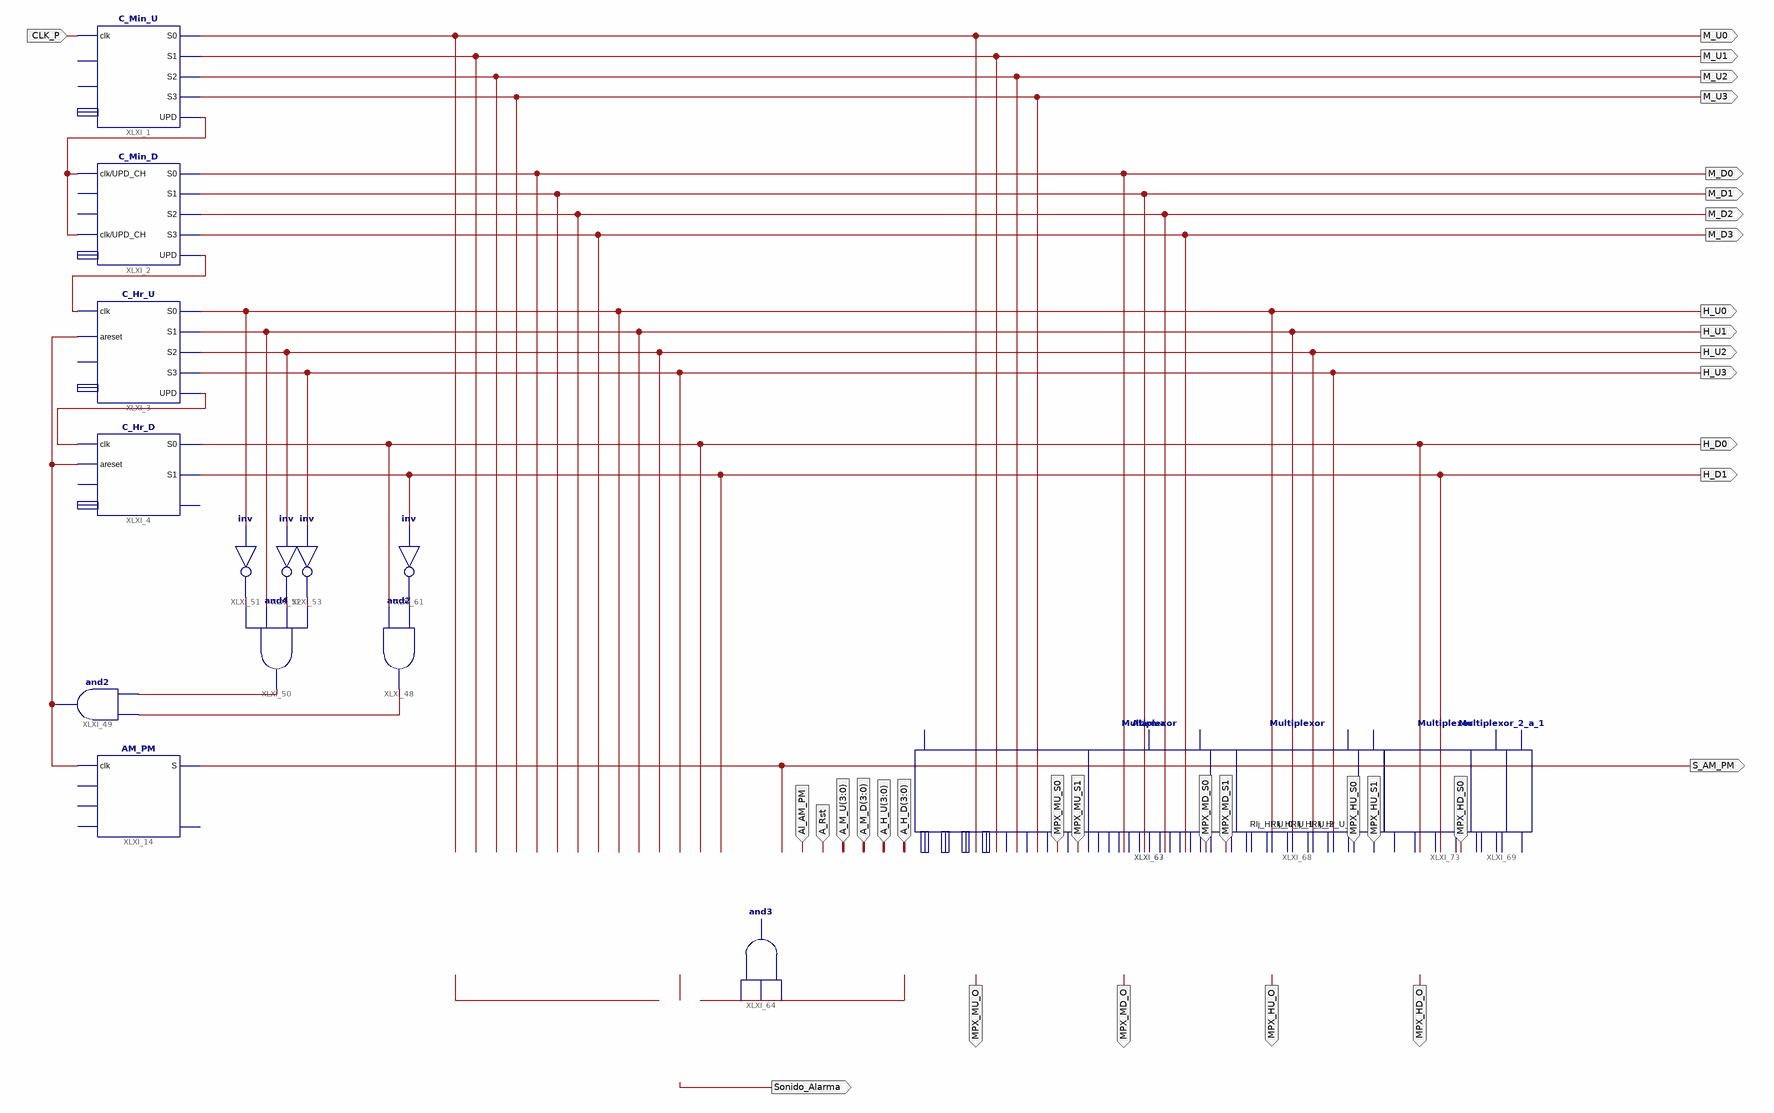
[diagram p0: schematic sheet 1]
// Xilinx ISE schematic Esquematico.sch (spartan3) as structural Verilog: 18 symbols, 34 ports
module Esquematico (
  input  CLK_P,
  input  Al_AM_PM,
  input  A_Rst,
  input  [3:0] A_M_U,
  input  [3:0] A_M_D,
  input  [3:0] A_H_U,
  input  [3:0] A_H_D,
  input  MPX_MU_S0,
  input  MPX_MU_S1,
  input  MPX_MD_S0,
  input  MPX_MD_S1,
  input  MPX_HU_S0,
  input  MPX_HU_S1,
  input  MPX_HD_S0,
  output M_U0,
  output M_U1,
  output M_U2,
  output M_U3,
  output M_D0,
  output M_D2,
  output M_D3,
  output M_D1,
  output H_U0,
  output H_D0,
  output H_U1,
  output H_U2,
  output H_U3,
  output H_D1,
  output S_AM_PM,
  output Sonido_Alarma,
  output MPX_HD_O,
  output MPX_HU_O,
  output MPX_MD_O,
  output MPX_MU_O
);

  wire XLXN_48, XLXN_51, XLXN_66, XLXN_128, XLXN_129, XLXN_130, XLXN_134, XLXN_143, XLXN_199, XLXN_201,
       XLXN_264, XLXN_265, XLXN_266;

  C_Min_U XLXI_1 (.clk(CLK_P), .S0(M_U0), .S1(M_U1), .S2(M_U2), .S3(M_U3), .UPD(XLXN_48));  // open: areset, aload, data
  C_Min_D XLXI_2 (
    .clk(XLXN_48), .UPD_CH(XLXN_48), .S0(M_D0), .S1(M_D1), .S2(M_D2), .S3(M_D3), .UPD(XLXN_51));  // open: areset, aload, data
  C_Hr_U XLXI_3 (
    .clk(XLXN_51), .areset(XLXN_201), .S0(H_U0), .S1(H_U1), .S2(H_U2), .S3(H_U3), .UPD(XLXN_66));  // open: aload, data
  C_Hr_D XLXI_4 (.clk(XLXN_66), .areset(XLXN_201), .S0(H_D0), .S1(H_D1));  // open: aload, data, UPD
  not XLXI_51 (XLXN_128, H_U0);
  not XLXI_52 (XLXN_129, H_U2);
  not XLXI_53 (XLXN_130, H_U3);
  and XLXI_50 (XLXN_143, XLXN_128, H_U1, XLXN_129, XLXN_130);
  and XLXI_48 (XLXN_199, H_D0, XLXN_134);
  not XLXI_61 (XLXN_134, H_D1);
  AM_PM XLXI_14 (.clk(XLXN_201), .S(S_AM_PM));  // open: areset, aload, data, UPD
  and XLXI_49 (XLXN_201, XLXN_199, XLXN_143);
  Alarma XLXI_63 (
    .Rlj_Min_U_0(M_U0), .Rlj_Min_U_1(M_U1), .Rlj_Min_U_2(M_U2), .Rlj_Min_U_3(M_U3), .Rlj_Min_D_0(M_D0),
    .Rlj_Min_D_1(M_D1), .Rlj_Min_D_2(M_D2), .Rlj_Min_D_3(M_D3), .Rlj_Hr_U_0(H_U0), .Rlj_Hr_U_1(H_U1),
    .Rlj_Hr_U_2(H_U2), .Rlj_Hr_U_3(H_U3), .Rlj_Hr_D_0(H_D0), .Rlj_Hr_D_1(H_D1), .Rlj_Am_Pm(S_AM_PM),
    .Alm_Am_Pm(Al_AM_PM), .Alm_Rst(A_Rst), .Alm_Min_U(A_M_U), .Alm_Min_D(A_M_D), .Alm_Hr_U(A_H_U),
    .Alm_Hr_D(A_H_D), .Sen_1(XLXN_264), .Sen_2(XLXN_265), .Sen_3(XLXN_266));  // open: Rlj_Hr_D_2, Rlj_Hr_D_3
  and XLXI_64 (Sonido_Alarma, XLXN_266, XLXN_265, XLXN_264);
  Multiplexor XLXI_68 (.A(M_D0), .B(M_D1), .C(M_D2), .D(M_D3), .S0(MPX_MD_S0), .S1(MPX_MD_S1), .Z(MPX_MD_O));
  Multiplexor_2_a_1 XLXI_69 (.p0(H_D0), .p1(H_D1), .sel(MPX_HD_S0), .s(MPX_HD_O));
  Multiplexor XLXI_67 (.A(M_U0), .B(M_U1), .C(M_U2), .D(M_U3), .S0(MPX_MU_S0), .S1(MPX_MU_S1), .Z(MPX_MU_O));
  Multiplexor XLXI_73 (.A(H_U0), .B(H_U1), .C(H_U2), .D(H_U3), .S0(MPX_HU_S0), .S1(MPX_HU_S1), .Z(MPX_HU_O));
endmodule
